# Altium project UZ_CarrierBoard.PrjPcb (part 10 of 10)
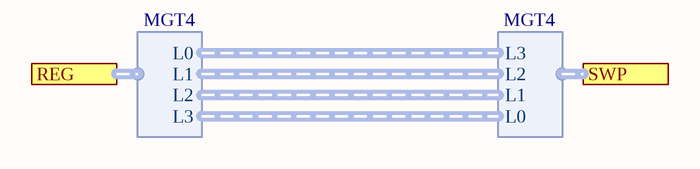
[diagram p42: Backpanel_SwapMGT4.SchDoc]

## Nets that join several sheets
1V8_PER: Signal_Distribution (R34ANL.2 R74.2 R75.2), U_Signal_Distribution/DIG1 (16 pins), U_Signal_Distribution/DIG2 (16 pins), U_Signal_Distribution/DIG3 (16 pins), U_Signal_Distribution/DIG4 (16 pins), U_Signal_Distribution/DIG5 (16 pins), Rail_Shutdown_AD (C82.1 U7.1), ETH-PHY (11 pins), SD_Card (C71.1 U13.5), isoDebug-Isolation (6 pins), Power_Supply_2 (R139.2 R139Y.2 R148.1), S3C_IOs1V8 (5 pins), S3C_SplitSPI (C118.2 U25.6 U25.16), S3C_FrontpanelInterface (R39.2 R40.2 R41.2), I2C_Subsystems (14 pins), I2C0_Mux (6 pins), Backpanel (R34BPs.2), U_Backpanel/U_Backpanel2T (X2A.20), U_Backpanel/U_Backpanel1B (X2B.20)
3V3_MOD: Signal_Distribution (R71.2), J1-3xGTHQ_R+B66 (5 pins), J2-1xGTHQ_L+1xGTHCLK+GTRQ+2xGTRCLK+4xPLLCLK+CFG+STAT (25 pins), J2_RefClkAndRTC (D4.2 L2.1), J3-3xGTHCLK+1xPLLCLK+MIO+B47+B48 (5 pins), Power_Supply_1 (10 pins)
3V3_PER: Signal_Distribution (5 pins), U_Signal_Distribution/DIG1 (18 pins), U_Signal_Distribution/DIG1/U_RP-SlotD (C78A.2 C79A.1 U9A.1), U_Signal_Distribution/DIG2 (18 pins), U_Signal_Distribution/DIG2/U_RP-SlotD (C78B.2 C79B.1 U9B.1), U_Signal_Distribution/DIG3 (18 pins), U_Signal_Distribution/DIG3/U_RP-SlotD (C78C.2 C79C.1 U9C.1), U_Signal_Distribution/DIG4 (18 pins), U_Signal_Distribution/DIG4/U_RP-SlotD (C78D.2 C79D.1 U9D.1), U_Signal_Distribution/DIG5 (18 pins), U_Signal_Distribution/DIG5/U_RP-SlotD (C78E.2 C79E.1 U9E.1), U_Signal_Distribution/ANL1/U_RP-SlotA (C78F.2 C79F.1 U9F.1), U_Signal_Distribution/ANL2/U_RP-SlotA (C78G.2 C79G.1 U9G.1), U_Signal_Distribution/ANL3/U_RP-SlotA (C78H.2 C79H.1 U9H.1), ANL_P54_Buffer (C116.2 L5.1 R32.1), ETH-PHY (5 pins), SD_Card (C72.2 U13.17 U13.21 X16.4), Thermal (9 pins), Power_Supply_1 (9 pins), Power_Supply_2 (D16.2 D18.2), S3C_IOs3V3 (U19.16), I2C_Subsystems (R67.2 R68.2 R69.2 X3.04), U_Backpanel/U_Backpanel2T (X2A.18), U_Backpanel/U_Backpanel1B (X2B.18)
3V3_S3C: Rail_Shutdown_AD (C83.1 U7.16), isoDebug-Isolation (Ci21.2 Ui7.10 Ui7.16), S3C (13 pins), S3C_IOs3V3 (10 pins), S3C_IOs1V8 (C114.2 U22.4 U22.6), S3C_SupplyAndMonitoring (6 pins), U_S3C_SupplyAndMonitoring/3V3_S3C (L12D.2 R140D.1 R141D.1 TP78D.1), U_S3C_SupplyAndMonitoring/U_PwrMon_VIN_10V (C139A.2 R106A.2 U28A.4), U_S3C_SupplyAndMonitoring/U_PwrMon_VIN_6V (C139B.2 R106B.2 U28B.4)
5V_PER: Signal_Distribution (R73.2), U_Signal_Distribution/DIG1/U_RP-SlotD (C36A.2 C39A.1 U8A.1), U_Signal_Distribution/DIG2/U_RP-SlotD (C36B.2 C39B.1 U8B.1), U_Signal_Distribution/DIG3/U_RP-SlotD (C36C.2 C39C.1 U8C.1), U_Signal_Distribution/DIG4/U_RP-SlotD (C36D.2 C39D.1 U8D.1), U_Signal_Distribution/DIG5/U_RP-SlotD (C36E.2 C39E.1 U8E.1), U_Signal_Distribution/ANL1/U_RP-SlotA (C36F.2 C39F.1 U8F.1), U_Signal_Distribution/ANL2/U_RP-SlotA (C36G.2 C39G.1 U8G.1), U_Signal_Distribution/ANL3/U_RP-SlotA (C36H.2 C39H.1 U8H.1), Power_Supply_1 (8 pins), S3C_FrontpanelInterface (U21.4), I2C_Subsystems (X3.05)
GND: Signal_Distribution (9 pins), U_Signal_Distribution/DIG1 (76 pins), U_Signal_Distribution/DIG1/U_RP-SlotD (18 pins), U_Signal_Distribution/DIG2 (76 pins), U_Signal_Distribution/DIG2/U_RP-SlotD (18 pins), U_Signal_Distribution/DIG3 (76 pins), U_Signal_Distribution/DIG3/U_RP-SlotD (18 pins), U_Signal_Distribution/DIG4 (76 pins), U_Signal_Distribution/DIG4/U_RP-SlotD (18 pins), U_Signal_Distribution/DIG5 (76 pins), U_Signal_Distribution/DIG5/U_RP-SlotD (18 pins), U_Signal_Distribution/ANL1 (30 pins), U_Signal_Distribution/ANL1/U_RP-SlotA (18 pins), U_Signal_Distribution/ANL2 (30 pins), U_Signal_Distribution/ANL2/U_RP-SlotA (18 pins), U_Signal_Distribution/ANL3 (30 pins), U_Signal_Distribution/ANL3/U_RP-SlotA (18 pins), Rail_Shutdown_AD (C82.2 C83.2 U7.2 U7.8), ANL_P54_Buffer (C84.1 C85.1 C116.1 U14.4), SoM (SNAP1.2 SNAP1.4), J1-3xGTHQ_R+B66 (50 pins), J2-1xGTHQ_L+1xGTHCLK+GTRQ+2xGTRCLK+4xPLLCLK+CFG+STAT (60 pins), J2_RefClkAndRTC (8 pins), J3-3xGTHCLK+1xPLLCLK+MIO+B47+B48 (30 pins), J4-B64+B65 (44 pins), ETH-PHY (21 pins), SD_Card (10 pins), User_Connectors (C92D.1 C93D.1), isoDebug-Isolation (9 pins), Thermal (10 pins), U_User_Connectors/12V_FAN (11 pins), Power_Supply_1 (53 pins), Power_Supply_2 (6 pins), U_Power_Supply_2/1V8_PER (11 pins), U_Power_Supply_2/1V8_MOD (11 pins), Power_Supply_Input (9 pins), S3C (20 pins), S3C_IOs3V3 (7 pins), S3C_IOs1V8 (7 pins), S3C_SplitSPI (C118.1 U25.4 U25.5 U25.8), S3C_FrontpanelInterface (U20.9 U21.9), S3C_SupplyAndMonitoring (12 pins), U_S3C_SupplyAndMonitoring/3V3_S3C (11 pins), U_S3C_SupplyAndMonitoring/U_PwrMon_VIN_10V (5 pins), U_S3C_SupplyAndMonitoring/U_PwrMon_VIN_6V (5 pins), I2C_Subsystems (8 pins), I2C0_Mux (C4.1 U6.12), Backpanel (7 pins), U_Backpanel/U_Backpanel2T (14 pins), U_Backpanel/U_Backpanel2T/U_RP-BP (5 pins), U_Backpanel/U_Backpanel1B (14 pins), U_Backpanel/U_Backpanel1B/U_RP-BP (5 pins)
isoDebug3V3: isoDebug (Ci1.2 Ri1.2 TPi2.1 Ui1.1), isoDebug-FTDI (16 pins), isoDebug-Isolation (9 pins)
isoDebugGND: isoDebug (6 pins), isoDebug-FTDI (22 pins), isoDebug-Isolation (9 pins)
PS_1V8: J2-1xGTHQ_L+1xGTHCLK+GTRQ+2xGTRCLK+4xPLLCLK+CFG+STAT (8 pins), J3-3xGTHCLK+1xPLLCLK+MIO+B47+B48 (J3.147 J3.148)
VCCO_47: J3-3xGTHCLK+1xPLLCLK+MIO+B47+B48 (J3.43 J3.44), Power_Supply_2 (R128.2)
VCCO_48: J3-3xGTHCLK+1xPLLCLK+MIO+B47+B48 (J3.15 J3.16), Power_Supply_2 (R129.2)
VCCO_64: J4-B64+B65 (J4.58 J4.106), Power_Supply_2 (R133.2)
VCCO_65: J4-B64+B65 (J4.69 J4.105), Power_Supply_2 (R131.2)
VCCO_66: J1-3xGTHQ_R+B66 (J1.90 J1.120), Power_Supply_2 (R136.2)
VIN: Signal_Distribution (R70.2), U_Signal_Distribution/DIG1/U_RP-SlotD (C86AD-A.2 R32AD-A.2 U1AD-A.8), U_Signal_Distribution/DIG2/U_RP-SlotD (C86AD-B.2 R32AD-B.2 U1AD-B.8), U_Signal_Distribution/DIG3/U_RP-SlotD (C86AD-C.2 R32AD-C.2 U1AD-C.8), U_Signal_Distribution/DIG4/U_RP-SlotD (C86AD-D.2 R32AD-D.2 U1AD-D.8), U_Signal_Distribution/DIG5/U_RP-SlotD (C86AD-E.2 R32AD-E.2 U1AD-E.8), U_Signal_Distribution/ANL1/U_RP-SlotA (C86AD-F.2 R32AD-F.2 U1AD-F.8), U_Signal_Distribution/ANL2/U_RP-SlotA (C86AD-G.2 R32AD-G.2 U1AD-G.8), U_Signal_Distribution/ANL3/U_RP-SlotA (C86AD-H.2 R32AD-H.2 U1AD-H.8), J2-1xGTHQ_L+1xGTHCLK+GTRQ+2xGTRCLK+4xPLLCLK+CFG+STAT (R8.2), U_User_Connectors/12V_FAN (L11A.2), Power_Supply_1 (L6.2 L7.2 L8.2), U_Power_Supply_2/1V8_PER (L11B.2), U_Power_Supply_2/1V8_MOD (L11C.2), Power_Supply_Input (12 pins), S3C_SupplyAndMonitoring (D6.2), U_Backpanel/U_Backpanel2T/U_RP-BP (C86BP-A.2 R32BP-A.2 U1BP-A.8), U_Backpanel/U_Backpanel1B/U_RP-BP (C86BP-B.2 R32BP-B.2 U1BP-B.8)
1V8out_MOD: Power_Supply_2 (C92A.2 C93A.2 R130.1), U_Power_Supply_2/1V8_MOD (L12C.2 R140C.1 R141C.1 TP78C.1)
1V8out_PER: Power_Supply_2 (C92B.2 C93B.2 R139.1), U_Power_Supply_2/1V8_PER (L12B.2 R140B.1 R141B.1 TP78B.1)
3V3_PROTECTED_ASLOT-_ANL1: U_Signal_Distribution/ANL1 (X5A.13 X5A.14), U_Signal_Distribution/ANL1/U_RP-SlotA (C80F.1 C81F.2 U9F.6)
3V3_PROTECTED_ASLOT-_ANL2: U_Signal_Distribution/ANL2 (X5B.13 X5B.14), U_Signal_Distribution/ANL2/U_RP-SlotA (C80G.1 C81G.2 U9G.6)
3V3_PROTECTED_ASLOT-_ANL3: U_Signal_Distribution/ANL3 (X5C.13 X5C.14), U_Signal_Distribution/ANL3/U_RP-SlotA (C80H.1 C81H.2 U9H.6)
3V3_PROTECTED_DSLOT-_DIG1: U_Signal_Distribution/DIG1 (X6A.13 X6A.14), U_Signal_Distribution/DIG1/U_RP-SlotD (C80A.1 C81A.2 U9A.6)
3V3_PROTECTED_DSLOT-_DIG2: U_Signal_Distribution/DIG2 (X6B.13 X6B.14), U_Signal_Distribution/DIG2/U_RP-SlotD (C80B.1 C81B.2 U9B.6)
3V3_PROTECTED_DSLOT-_DIG3: U_Signal_Distribution/DIG3 (X6C.13 X6C.14), U_Signal_Distribution/DIG3/U_RP-SlotD (C80C.1 C81C.2 U9C.6)
3V3_PROTECTED_DSLOT-_DIG4: U_Signal_Distribution/DIG4 (X6D.13 X6D.14), U_Signal_Distribution/DIG4/U_RP-SlotD (C80D.1 C81D.2 U9D.6)
3V3_PROTECTED_DSLOT-_DIG5: U_Signal_Distribution/DIG5 (X6E.13 X6E.14), U_Signal_Distribution/DIG5/U_RP-SlotD (C80E.1 C81E.2 U9E.6)
5V_PROTECTED_ASLOT-_ANL1: U_Signal_Distribution/ANL1 (X5A.9 X5A.10), U_Signal_Distribution/ANL1/U_RP-SlotA (C76F.1 C77F.2 U8F.6)
5V_PROTECTED_ASLOT-_ANL2: U_Signal_Distribution/ANL2 (X5B.9 X5B.10), U_Signal_Distribution/ANL2/U_RP-SlotA (C76G.1 C77G.2 U8G.6)
5V_PROTECTED_ASLOT-_ANL3: U_Signal_Distribution/ANL3 (X5C.9 X5C.10), U_Signal_Distribution/ANL3/U_RP-SlotA (C76H.1 C77H.2 U8H.6)
5V_PROTECTED_DSLOT-_DIG1: U_Signal_Distribution/DIG1 (X6A.9 X6A.10), U_Signal_Distribution/DIG1/U_RP-SlotD (C76A.1 C77A.2 U8A.6)
5V_PROTECTED_DSLOT-_DIG2: U_Signal_Distribution/DIG2 (X6B.9 X6B.10), U_Signal_Distribution/DIG2/U_RP-SlotD (C76B.1 C77B.2 U8B.6)
5V_PROTECTED_DSLOT-_DIG3: U_Signal_Distribution/DIG3 (X6C.9 X6C.10), U_Signal_Distribution/DIG3/U_RP-SlotD (C76C.1 C77C.2 U8C.6)
5V_PROTECTED_DSLOT-_DIG4: U_Signal_Distribution/DIG4 (X6D.9 X6D.10), U_Signal_Distribution/DIG4/U_RP-SlotD (C76D.1 C77D.2 U8D.6)
5V_PROTECTED_DSLOT-_DIG5: U_Signal_Distribution/DIG5 (X6E.9 X6E.10), U_Signal_Distribution/DIG5/U_RP-SlotD (C76E.1 C77E.2 U8E.6)
12V_FAN: User_Connectors (C92D.2 C93D.2), Thermal (6 pins), U_User_Connectors/12V_FAN (L12A.2 R140A.1 R141A.1 TP78A.1)
ADDR0: Signal_Distribution (NT1.1), U_Signal_Distribution/ANL1 (X5A.61)
ADDR0: Signal_Distribution (NT4.1), U_Signal_Distribution/ANL3 (X5C.61)
ADDR0_D2: Signal_Distribution (NT6.1), U_Signal_Distribution/DIG2 (X6B.79)
ADDR0_D4: Signal_Distribution (NT9.1), U_Signal_Distribution/DIG4 (X6D.79)
ADDR1: Signal_Distribution (NT2.1), U_Signal_Distribution/ANL1 (X5A.77)
ADDR1: Signal_Distribution (NT3.1), U_Signal_Distribution/ANL2 (X5B.77)
ADDR1_D2: Signal_Distribution (NT7.1), U_Signal_Distribution/DIG2 (X6B.95)
ADDR1_D3: Signal_Distribution (NT8.1), U_Signal_Distribution/DIG3 (X6C.95)
ADDR2_D1: Signal_Distribution (NT5.1), U_Signal_Distribution/DIG1 (X6A.80)
ANL_00_N: U_Signal_Distribution/ANL1 (X5A.19), J4-B64+B65 (J4.126)
ANL_00_N: U_Signal_Distribution/ANL2 (X5B.19), J4-B64+B65 (J4.80)
ANL_00_N: U_Signal_Distribution/ANL3 (X5C.19), J4-B64+B65 (J4.65)
ANL_00_P: U_Signal_Distribution/ANL1 (X5A.17), J4-B64+B65 (J4.128)
ANL_00_P: U_Signal_Distribution/ANL2 (X5B.17), J4-B64+B65 (J4.78)
ANL_00_P: U_Signal_Distribution/ANL3 (X5C.17), J4-B64+B65 (J4.67)
ANL_01_N: U_Signal_Distribution/ANL1 (X5A.20), J4-B64+B65 (J4.144)
ANL_01_N: U_Signal_Distribution/ANL2 (X5B.20), J4-B64+B65 (J4.90)
ANL_01_N: U_Signal_Distribution/ANL3 (X5C.20), J4-B64+B65 (J4.44)
ANL_01_P: U_Signal_Distribution/ANL1 (X5A.18), J4-B64+B65 (J4.146)
ANL_01_P: U_Signal_Distribution/ANL2 (X5B.18), J4-B64+B65 (J4.92)
ANL_01_P: U_Signal_Distribution/ANL3 (X5C.18), J4-B64+B65 (J4.42)
ANL_02_N: U_Signal_Distribution/ANL1 (X5A.25), J4-B64+B65 (J4.138)
ANL_02_N: U_Signal_Distribution/ANL2 (X5B.25), J4-B64+B65 (J4.84)
ANL_02_N: U_Signal_Distribution/ANL3 (X5C.25), J4-B64+B65 (J4.38)
ANL_02_P: U_Signal_Distribution/ANL1 (X5A.23), J4-B64+B65 (J4.140)
ANL_02_P: U_Signal_Distribution/ANL2 (X5B.23), J4-B64+B65 (J4.86)
ANL_02_P: U_Signal_Distribution/ANL3 (X5C.23), J4-B64+B65 (J4.36)
ANL_03_N: U_Signal_Distribution/ANL1 (X5A.26), J4-B64+B65 (J4.132)
ANL_03_N: U_Signal_Distribution/ANL2 (X5B.26), J4-B64+B65 (J4.96)
ANL_03_N: U_Signal_Distribution/ANL3 (X5C.26), J4-B64+B65 (J4.35)
ANL_03_P: U_Signal_Distribution/ANL1 (X5A.24), J4-B64+B65 (J4.134)
ANL_03_P: U_Signal_Distribution/ANL2 (X5B.24), J4-B64+B65 (J4.98)
ANL_03_P: U_Signal_Distribution/ANL3 (X5C.24), J4-B64+B65 (J4.37)
ANL_04_N: U_Signal_Distribution/ANL1 (X5A.31), J4-B64+B65 (J4.133)
ANL_04_N: U_Signal_Distribution/ANL2 (X5B.31), J4-B64+B65 (J4.48)
ANL_04_N: U_Signal_Distribution/ANL3 (X5C.31), J4-B64+B65 (J4.30)
ANL_04_P: U_Signal_Distribution/ANL1 (X5A.29), J4-B64+B65 (J4.131)
ANL_04_P: U_Signal_Distribution/ANL2 (X5B.29), J4-B64+B65 (J4.50)
ANL_04_P: U_Signal_Distribution/ANL3 (X5C.29), J4-B64+B65 (J4.32)
ANL_05_N: U_Signal_Distribution/ANL1 (X5A.32), J4-B64+B65 (J4.152)
ANL_05_N: U_Signal_Distribution/ANL2 (X5B.32), J4-B64+B65 (J4.66)
ANL_05_N: U_Signal_Distribution/ANL3 (X5C.32), J4-B64+B65 (J4.31)
ANL_05_P: U_Signal_Distribution/ANL1 (X5A.30), J4-B64+B65 (J4.150)
ANL_05_P: U_Signal_Distribution/ANL2 (X5B.30), J4-B64+B65 (J4.68)
ANL_05_P: U_Signal_Distribution/ANL3 (X5C.30), J4-B64+B65 (J4.29)
ANL_06_N: U_Signal_Distribution/ANL1 (X5A.37), J4-B64+B65 (J4.120)
ANL_06_N: U_Signal_Distribution/ANL2 (X5B.37), J4-B64+B65 (J4.62)
ANL_06_N: U_Signal_Distribution/ANL3 (X5C.37), J4-B64+B65 (J4.26)
ANL_06_P: U_Signal_Distribution/ANL1 (X5A.35), J4-B64+B65 (J4.122)
ANL_06_P: U_Signal_Distribution/ANL2 (X5B.35), J4-B64+B65 (J4.60)
ANL_06_P: U_Signal_Distribution/ANL3 (X5C.35), J4-B64+B65 (J4.24)
ANL_07_N: U_Signal_Distribution/ANL1 (X5A.38), J4-B64+B65 (J4.116)
ANL_07_N: U_Signal_Distribution/ANL2 (X5B.38), J4-B64+B65 (J4.56)
ANL_07_N: U_Signal_Distribution/ANL3 (X5C.38), J4-B64+B65 (J4.20)
ANL_07_P: U_Signal_Distribution/ANL1 (X5A.36), J4-B64+B65 (J4.114)
ANL_07_P: U_Signal_Distribution/ANL2 (X5B.36), J4-B64+B65 (J4.54)
ANL_07_P: U_Signal_Distribution/ANL3 (X5C.36), J4-B64+B65 (J4.18)
ANL_08_N: U_Signal_Distribution/ANL1 (X5A.43), J4-B64+B65 (J4.108)
ANL_08_N: U_Signal_Distribution/ANL2 (X5B.43), J4-B64+B65 (J4.55)
ANL_08_N: U_Signal_Distribution/ANL3 (X5C.43), J4-B64+B65 (J4.17)
ANL_08_P: U_Signal_Distribution/ANL1 (X5A.41), J4-B64+B65 (J4.110)
ANL_08_P: U_Signal_Distribution/ANL2 (X5B.41), J4-B64+B65 (J4.53)
ANL_08_P: U_Signal_Distribution/ANL3 (X5C.41), J4-B64+B65 (J4.19)
ANL_09_N: U_Signal_Distribution/ANL1 (X5A.44), J4-B64+B65 (J4.91)
ANL_09_N: U_Signal_Distribution/ANL2 (X5B.44), J4-B64+B65 (J4.72)
ANL_09_N: U_Signal_Distribution/ANL3 (X5C.44), J4-B64+B65 (J4.77)
ANL_09_P: U_Signal_Distribution/ANL1 (X5A.42), J4-B64+B65 (J4.89)
ANL_09_P: U_Signal_Distribution/ANL2 (X5B.42), J4-B64+B65 (J4.74)
ANL_09_P: U_Signal_Distribution/ANL3 (X5C.42), J4-B64+B65 (J4.79)
ANL_P54_Clk1: U_Signal_Distribution/ANL1 (X5A.54), ANL_P54_Buffer (R36.1)
ANL_P54_Clk2: U_Signal_Distribution/ANL2 (X5B.54), ANL_P54_Buffer (R35.1)
ANL_P54_Clk3: U_Signal_Distribution/ANL3 (X5C.54), ANL_P54_Buffer (R34.1)
ANL_Rail~{FAULT}: Signal_Distribution (R35ANL.2), S3C_IOs1V8 (U19.42)
ANL_S3C.CarrierReady: U_Signal_Distribution/ANL1 (X5A.79), U_Signal_Distribution/ANL2 (X5B.79), U_Signal_Distribution/ANL3 (X5C.79)
ASlots_SCL_3V3: Signal_Distribution (R97.1), U_Signal_Distribution/ANL1 (X5A.49), U_Signal_Distribution/ANL2 (X5B.49), U_Signal_Distribution/ANL3 (X5C.49), I2C0_Mux (U6.7)
ASlots_SDA_3V3: Signal_Distribution (R99.1), U_Signal_Distribution/ANL1 (X5A.50), U_Signal_Distribution/ANL2 (X5B.50), U_Signal_Distribution/ANL3 (X5C.50), I2C0_Mux (U6.6)
B64_L5_N: U_Signal_Distribution/DIG1 (U4A.43), J4-B64+B65 (J4.104)
B64_L5_P: U_Signal_Distribution/DIG1 (U4A.45), J4-B64+B65 (J4.102)
B64_L24_N: U_Signal_Distribution/DIG1 (U4A.99), J4-B64+B65 (J4.12)
B64_L24_P: U_Signal_Distribution/DIG1 (U4A.98), J4-B64+B65 (J4.14)
B64_T0: J4-B64+B65 (J4.8), S3C_IOs1V8 (U19.73)
B64_T1: J4-B64+B65 (J4.6), S3C_IOs1V8 (U19.74)
B64_T2: J4-B64+B65 (J4.2), S3C_IOs1V8 (U19.76)
B64_T3: J4-B64+B65 (J4.4), S3C_IOs1V8 (U19.75)
B65_L1_N: U_Signal_Distribution/DIG1 (U4A.30), J4-B64+B65 (J4.145)
B65_L1_P: U_Signal_Distribution/DIG1 (U4A.29), J4-B64+B65 (J4.143)
B65_L2_N: U_Signal_Distribution/DIG1 (U4A.18), J4-B64+B65 (J4.125)
B65_L2_P: U_Signal_Distribution/DIG1 (U4A.19), J4-B64+B65 (J4.127)
B65_L3_N: U_Signal_Distribution/DIG1 (U4A.20), J4-B64+B65 (J4.137)
B65_L3_P: U_Signal_Distribution/DIG1 (U4A.21), J4-B64+B65 (J4.139)
B65_L4_N: U_Signal_Distribution/DIG1 (U4A.38), J4-B64+B65 (J4.107)
B65_L4_P: U_Signal_Distribution/DIG1 (U4A.34), J4-B64+B65 (J4.109)
B65_L5_N: U_Signal_Distribution/DIG1 (U4A.28), J4-B64+B65 (J4.151)
B65_L5_P: U_Signal_Distribution/DIG1 (U4A.27), J4-B64+B65 (J4.149)
B65_L6_N: U_Signal_Distribution/DIG1 (U4A.84), J4-B64+B65 (J4.83)
B65_L6_P: U_Signal_Distribution/DIG1 (U4A.47), J4-B64+B65 (J4.85)
B65_L7_N: U_Signal_Distribution/DIG1 (U4A.78), J4-B64+B65 (J4.71)
B65_L7_P: U_Signal_Distribution/DIG1 (U4A.83), J4-B64+B65 (J4.73)
B65_L8_N: U_Signal_Distribution/DIG1 (U4A.24), J4-B64+B65 (J4.121)
B65_L8_P: U_Signal_Distribution/DIG1 (U4A.37), J4-B64+B65 (J4.119)
B65_L9_N: U_Signal_Distribution/DIG1 (U4A.41), J4-B64+B65 (J4.101)
B65_L9_P: U_Signal_Distribution/DIG1 (U4A.39), J4-B64+B65 (J4.103)
B65_L10_N: U_Signal_Distribution/DIG1 (U4A.42), J4-B64+B65 (J4.95)
B65_L10_P: U_Signal_Distribution/DIG1 (U4A.40), J4-B64+B65 (J4.97)
B65_L14_N: U_Signal_Distribution/DIG1 (U4A.35), J4-B64+B65 (J4.113)
B65_L14_P: U_Signal_Distribution/DIG1 (U4A.36), J4-B64+B65 (J4.115)
B65_L15_N: U_Signal_Distribution/DIG1 (U4A.88), J4-B64+B65 (J4.59)
B65_L15_P: U_Signal_Distribution/DIG1 (U4A.87), J4-B64+B65 (J4.61)
B65_L19_N: U_Signal_Distribution/DIG1 (U4A.97), J4-B64+B65 (J4.49)
B65_L19_P: U_Signal_Distribution/DIG1 (U4A.96), J4-B64+B65 (J4.47)
B65_L22_N: U_Signal_Distribution/DIG2 (U4B.30), J4-B64+B65 (J4.25)
B65_L22_P: U_Signal_Distribution/DIG2 (U4B.29), J4-B64+B65 (J4.23)
B65_L23_N: U_Signal_Distribution/DIG2 (U4B.27), J4-B64+B65 (J4.41)
B65_L23_P: U_Signal_Distribution/DIG2 (U4B.28), J4-B64+B65 (J4.43)
B65_L24_N: U_Signal_Distribution/DIG2 (U4B.21), J4-B64+B65 (J4.13)
B65_L24_P: U_Signal_Distribution/DIG2 (U4B.20), J4-B64+B65 (J4.11)
B65_T0: U_Signal_Distribution/DIG2 (U4B.19), J4-B64+B65 (J4.7)
B65_T1: U_Signal_Distribution/DIG2 (U4B.18), J4-B64+B65 (J4.5)
B65_T2: U_Signal_Distribution/DIG2 (U4B.24), J4-B64+B65 (J4.3)
B65_T3: U_Signal_Distribution/DIG2 (U4B.37), J4-B64+B65 (J4.1)
B66_L23_N: J1-3xGTHQ_R+B66 (J1.110), S3C_IOs1V8 (U19.78)
B66_L23_P: J1-3xGTHQ_R+B66 (J1.112), S3C_IOs1V8 (U19.77)
B128_CLK1_N: J2-1xGTHQ_L+1xGTHCLK+GTRQ+2xGTRCLK+4xPLLCLK+CFG+STAT (J2.24), U_Backpanel/U_Backpanel2T (X2A.4)
B128_CLK1_P: J2-1xGTHQ_L+1xGTHCLK+GTRQ+2xGTRCLK+4xPLLCLK+CFG+STAT (J2.22), U_Backpanel/U_Backpanel2T (X2A.6)
B230_CLK1_N: J3-3xGTHCLK+1xPLLCLK+MIO+B47+B48 (J3.59), U_Backpanel/U_Backpanel1B (X2B.4)
B230_CLK1_P: J3-3xGTHCLK+1xPLLCLK+MIO+B47+B48 (J3.61), U_Backpanel/U_Backpanel1B (X2B.6)
B505_CLKb_N: J2-1xGTHQ_L+1xGTHCLK+GTRQ+2xGTRCLK+4xPLLCLK+CFG+STAT (J2.18), J2_RefClkAndRTC (C97.2)
B505_CLKb_P: J2-1xGTHQ_L+1xGTHCLK+GTRQ+2xGTRCLK+4xPLLCLK+CFG+STAT (J2.16), J2_RefClkAndRTC (C2.2)
Carrier_PG_1V8: Rail_Shutdown_AD (R15.1), ETH-PHY (R210.1 U2.16), S3C_IOs1V8 (U19.107)
Carrier_PwrOn: User_Connectors (R203D.1), Power_Supply_1 (R108.2 U10.3), S3C_IOs3V3 (U19.1)
CLK0_N: GTH (C152.1), J2-1xGTHQ_L+1xGTHCLK+GTRQ+2xGTRCLK+4xPLLCLK+CFG+STAT (J2.1)
CLK0_P: GTH (C151.1), J2-1xGTHQ_L+1xGTHCLK+GTRQ+2xGTRCLK+4xPLLCLK+CFG+STAT (J2.3)
CLK7_N: GTH (C101.1), J2-1xGTHQ_L+1xGTHCLK+GTRQ+2xGTRCLK+4xPLLCLK+CFG+STAT (J2.15)
CLK7_P: GTH (C100.1), J2-1xGTHQ_L+1xGTHCLK+GTRQ+2xGTRCLK+4xPLLCLK+CFG+STAT (J2.13)
CLK8_N: GTH (C150.1), J2-1xGTHQ_L+1xGTHCLK+GTRQ+2xGTRCLK+4xPLLCLK+CFG+STAT (J2.9)
CLK8_P: GTH (C149.1), J2-1xGTHQ_L+1xGTHCLK+GTRQ+2xGTRCLK+4xPLLCLK+CFG+STAT (J2.7)
CPLD_TCK: U_Signal_Distribution/DIG1 (U4A.91), U_Signal_Distribution/DIG2 (U4B.91), U_Signal_Distribution/DIG3 (U4C.91), U_Signal_Distribution/DIG4 (U4D.91), U_Signal_Distribution/DIG5 (U4E.91)
CPLD_TDI2: U_Signal_Distribution/DIG1 (U4A.95), U_Signal_Distribution/DIG2 (U4B.94)
CPLD_TDI3: U_Signal_Distribution/DIG2 (U4B.95), U_Signal_Distribution/DIG3 (U4C.94)
CPLD_TDI4: U_Signal_Distribution/DIG3 (U4C.95), U_Signal_Distribution/DIG4 (U4D.94)
CPLD_TDI5: U_Signal_Distribution/DIG4 (U4D.95), U_Signal_Distribution/DIG5 (U4E.94)
CPLD_TMS: U_Signal_Distribution/DIG1 (U4A.90), U_Signal_Distribution/DIG2 (U4B.90), U_Signal_Distribution/DIG3 (U4C.90), U_Signal_Distribution/DIG4 (U4D.90), U_Signal_Distribution/DIG5 (U4E.90)
CPLDs_SCL_1V8: Signal_Distribution (R74.1), U_Signal_Distribution/DIG1 (U4A.86), U_Signal_Distribution/DIG2 (U4B.86), U_Signal_Distribution/DIG3 (U4C.86), U_Signal_Distribution/DIG4 (U4D.86), U_Signal_Distribution/DIG5 (U4E.86), I2C0_Mux (U6.9)
CPLDs_SDA_1V8: Signal_Distribution (R75.1), U_Signal_Distribution/DIG1 (U4A.85), U_Signal_Distribution/DIG2 (U4B.85), U_Signal_Distribution/DIG3 (U4C.85), U_Signal_Distribution/DIG4 (U4D.85), U_Signal_Distribution/DIG5 (U4E.85), I2C0_Mux (U6.8)
DIG_00_Ch2: U_Signal_Distribution/DIG2 (U4B.78), J1-3xGTHQ_R+B66 (J1.130)
DIG_00_Ch3: U_Signal_Distribution/DIG3 (U4C.78), J1-3xGTHQ_R+B66 (J1.80)
DIG_00_Ch4: U_Signal_Distribution/DIG4 (U4D.78), J3-3xGTHCLK+1xPLLCLK+MIO+B47+B48 (J3.32)
DIG_00_Ch5: U_Signal_Distribution/DIG5 (U4E.78), S3C_IOs1V8 (U19.28)
DIG_01_Ch2: U_Signal_Distribution/DIG2 (U4B.83), J1-3xGTHQ_R+B66 (J1.131)
DIG_01_Ch3: U_Signal_Distribution/DIG3 (U4C.83), J1-3xGTHQ_R+B66 (J1.81)
DIG_01_Ch4: U_Signal_Distribution/DIG4 (U4D.83), J3-3xGTHCLK+1xPLLCLK+MIO+B47+B48 (J3.31)
DIG_01_Ch5: U_Signal_Distribution/DIG5 (U4E.83), S3C_IOs1V8 (U19.32)
DIG_02_Ch2: U_Signal_Distribution/DIG2 (U4B.84), J1-3xGTHQ_R+B66 (J1.134)
DIG_02_Ch3: U_Signal_Distribution/DIG3 (U4C.84), J1-3xGTHQ_R+B66 (J1.82)
DIG_02_Ch4: U_Signal_Distribution/DIG4 (U4D.84), J3-3xGTHCLK+1xPLLCLK+MIO+B47+B48 (J3.28)
DIG_02_Ch5: U_Signal_Distribution/DIG5 (U4E.84), S3C_IOs1V8 (U19.31)
DIG_03_Ch2: U_Signal_Distribution/DIG2 (U4B.47), J1-3xGTHQ_R+B66 (J1.135)
DIG_03_Ch3: U_Signal_Distribution/DIG3 (U4C.47), J1-3xGTHQ_R+B66 (J1.83)
DIG_03_Ch4: U_Signal_Distribution/DIG4 (U4D.47), J3-3xGTHCLK+1xPLLCLK+MIO+B47+B48 (J3.27)
DIG_03_Ch5: U_Signal_Distribution/DIG5 (U4E.47), S3C_IOs1V8 (U19.25)
DIG_04_Ch2: U_Signal_Distribution/DIG2 (U4B.45), J1-3xGTHQ_R+B66 (J1.136)
DIG_04_Ch3: U_Signal_Distribution/DIG3 (U4C.45), J1-3xGTHQ_R+B66 (J1.86)
DIG_04_Ch4: U_Signal_Distribution/DIG4 (U4D.45), J3-3xGTHCLK+1xPLLCLK+MIO+B47+B48 (J3.26)
DIG_04_Ch5: U_Signal_Distribution/DIG5 (U4E.45), S3C_IOs1V8 (U19.26)
DIG_05_Ch2: U_Signal_Distribution/DIG2 (U4B.43), J1-3xGTHQ_R+B66 (J1.137)
DIG_05_Ch3: U_Signal_Distribution/DIG3 (U4C.43), J1-3xGTHQ_R+B66 (J1.87)
DIG_05_Ch4: U_Signal_Distribution/DIG4 (U4D.43), J3-3xGTHCLK+1xPLLCLK+MIO+B47+B48 (J3.25)
DIG_05_Ch5: U_Signal_Distribution/DIG5 (U4E.43), S3C_IOs1V8 (U19.27)
DIG_06_Ch2: U_Signal_Distribution/DIG2 (U4B.42), J1-3xGTHQ_R+B66 (J1.140)
DIG_06_Ch3: U_Signal_Distribution/DIG3 (U4C.42), J1-3xGTHQ_R+B66 (J1.88)
DIG_06_Ch4: U_Signal_Distribution/DIG4 (U4D.42), J3-3xGTHCLK+1xPLLCLK+MIO+B47+B48 (J3.24)
DIG_06_Ch5: U_Signal_Distribution/DIG5 (U4E.42), J1-3xGTHQ_R+B66 (J1.119)
DIG_07_Ch2: U_Signal_Distribution/DIG2 (U4B.40), J1-3xGTHQ_R+B66 (J1.141)
DIG_07_Ch3: U_Signal_Distribution/DIG3 (U4C.40), J1-3xGTHQ_R+B66 (J1.89)
DIG_07_Ch4: U_Signal_Distribution/DIG4 (U4D.40), J3-3xGTHCLK+1xPLLCLK+MIO+B47+B48 (J3.23)
DIG_07_Ch5: U_Signal_Distribution/DIG5 (U4E.40), J1-3xGTHQ_R+B66 (J1.117)
DIG_08_Ch2: U_Signal_Distribution/DIG2 (U4B.41), J1-3xGTHQ_R+B66 (J1.142)
DIG_08_Ch3: U_Signal_Distribution/DIG3 (U4C.41), J1-3xGTHQ_R+B66 (J1.92)
DIG_08_Ch4: U_Signal_Distribution/DIG4 (U4D.41), J3-3xGTHCLK+1xPLLCLK+MIO+B47+B48 (J3.22)
DIG_08_Ch5: U_Signal_Distribution/DIG5 (U4E.41), J3-3xGTHCLK+1xPLLCLK+MIO+B47+B48 (J3.56)
DIG_09_Ch2: U_Signal_Distribution/DIG2 (U4B.39), J1-3xGTHQ_R+B66 (J1.143)
DIG_09_Ch3: U_Signal_Distribution/DIG3 (U4C.39), J1-3xGTHQ_R+B66 (J1.93)
DIG_09_Ch4: U_Signal_Distribution/DIG4 (U4D.39), J3-3xGTHCLK+1xPLLCLK+MIO+B47+B48 (J3.21)
DIG_09_Ch5: U_Signal_Distribution/DIG5 (U4E.39), J3-3xGTHCLK+1xPLLCLK+MIO+B47+B48 (J3.55)
DIG_10_Ch2: U_Signal_Distribution/DIG2 (U4B.38), J1-3xGTHQ_R+B66 (J1.145)
DIG_10_Ch3: U_Signal_Distribution/DIG3 (U4C.38), J1-3xGTHQ_R+B66 (J1.94)
DIG_10_Ch4: U_Signal_Distribution/DIG4 (U4D.38), J3-3xGTHCLK+1xPLLCLK+MIO+B47+B48 (J3.20)
DIG_10_Ch5: U_Signal_Distribution/DIG5 (U4E.38), J3-3xGTHCLK+1xPLLCLK+MIO+B47+B48 (J3.54)
DIG_11_Ch2: U_Signal_Distribution/DIG2 (U4B.34), J1-3xGTHQ_R+B66 (J1.146)
DIG_11_Ch3: U_Signal_Distribution/DIG3 (U4C.34), J1-3xGTHQ_R+B66 (J1.95)
DIG_11_Ch4: U_Signal_Distribution/DIG4 (U4D.34), J3-3xGTHCLK+1xPLLCLK+MIO+B47+B48 (J3.19)
DIG_11_Ch5: U_Signal_Distribution/DIG5 (U4E.34), J3-3xGTHCLK+1xPLLCLK+MIO+B47+B48 (J3.53)
DIG_12_Ch2: U_Signal_Distribution/DIG2 (U4B.35), J1-3xGTHQ_R+B66 (J1.147)
DIG_12_Ch3: U_Signal_Distribution/DIG3 (U4C.35), J1-3xGTHQ_R+B66 (J1.98)
DIG_12_Ch4: U_Signal_Distribution/DIG4 (U4D.35), J3-3xGTHCLK+1xPLLCLK+MIO+B47+B48 (J3.18)
DIG_12_Ch5: U_Signal_Distribution/DIG5 (U4E.35), J3-3xGTHCLK+1xPLLCLK+MIO+B47+B48 (J3.52)
DIG_13_Ch2: U_Signal_Distribution/DIG2 (U4B.36), J1-3xGTHQ_R+B66 (J1.148)
DIG_13_Ch3: U_Signal_Distribution/DIG3 (U4C.36), J1-3xGTHQ_R+B66 (J1.99)
DIG_13_Ch4: U_Signal_Distribution/DIG4 (U4D.36), J3-3xGTHCLK+1xPLLCLK+MIO+B47+B48 (J3.17)
DIG_13_Ch5: U_Signal_Distribution/DIG5 (U4E.36), J3-3xGTHCLK+1xPLLCLK+MIO+B47+B48 (J3.51)
DIG_14_Ch3: U_Signal_Distribution/DIG3 (U4C.37), J1-3xGTHQ_R+B66 (J1.100)
DIG_14_Ch4: U_Signal_Distribution/DIG4 (U4D.37), J3-3xGTHCLK+1xPLLCLK+MIO+B47+B48 (J3.14)
DIG_14_Ch5: U_Signal_Distribution/DIG5 (U4E.37), J3-3xGTHCLK+1xPLLCLK+MIO+B47+B48 (J3.50)
DIG_15_Ch3: U_Signal_Distribution/DIG3 (U4C.24), J1-3xGTHQ_R+B66 (J1.101)
DIG_15_Ch4: U_Signal_Distribution/DIG4 (U4D.24), J3-3xGTHCLK+1xPLLCLK+MIO+B47+B48 (J3.13)
DIG_15_Ch5: U_Signal_Distribution/DIG5 (U4E.24), J3-3xGTHCLK+1xPLLCLK+MIO+B47+B48 (J3.49)
DIG_16_Ch3: U_Signal_Distribution/DIG3 (U4C.18), J1-3xGTHQ_R+B66 (J1.104)
DIG_16_Ch4: U_Signal_Distribution/DIG4 (U4D.18), J3-3xGTHCLK+1xPLLCLK+MIO+B47+B48 (J3.12)
DIG_16_Ch5: U_Signal_Distribution/DIG5 (U4E.18), J3-3xGTHCLK+1xPLLCLK+MIO+B47+B48 (J3.48)
DIG_17_Ch3: U_Signal_Distribution/DIG3 (U4C.19), J1-3xGTHQ_R+B66 (J1.105)
DIG_17_Ch4: U_Signal_Distribution/DIG4 (U4D.19), J3-3xGTHCLK+1xPLLCLK+MIO+B47+B48 (J3.11)
DIG_17_Ch5: U_Signal_Distribution/DIG5 (U4E.19), J3-3xGTHCLK+1xPLLCLK+MIO+B47+B48 (J3.47)
DIG_18_Ch3: U_Signal_Distribution/DIG3 (U4C.20), J1-3xGTHQ_R+B66 (J1.106)
DIG_18_Ch4: U_Signal_Distribution/DIG4 (U4D.20), J3-3xGTHCLK+1xPLLCLK+MIO+B47+B48 (J3.10)
DIG_18_Ch5: U_Signal_Distribution/DIG5 (U4E.20), J3-3xGTHCLK+1xPLLCLK+MIO+B47+B48 (J3.46)
DIG_19_Ch3: U_Signal_Distribution/DIG3 (U4C.21), J1-3xGTHQ_R+B66 (J1.107)
DIG_19_Ch4: U_Signal_Distribution/DIG4 (U4D.21), J3-3xGTHCLK+1xPLLCLK+MIO+B47+B48 (J3.9)
DIG_19_Ch5: U_Signal_Distribution/DIG5 (U4E.21), J3-3xGTHCLK+1xPLLCLK+MIO+B47+B48 (J3.45)
DIG_20_Ch3: U_Signal_Distribution/DIG3 (U4C.29), J1-3xGTHQ_R+B66 (J1.111)
DIG_20_Ch4: U_Signal_Distribution/DIG4 (U4D.29), J3-3xGTHCLK+1xPLLCLK+MIO+B47+B48 (J3.8)
DIG_20_Ch5: U_Signal_Distribution/DIG5 (U4E.29), J3-3xGTHCLK+1xPLLCLK+MIO+B47+B48 (J3.42)
DIG_21_Ch3: U_Signal_Distribution/DIG3 (U4C.30), J1-3xGTHQ_R+B66 (J1.113)
DIG_21_Ch4: U_Signal_Distribution/DIG4 (U4D.30), J3-3xGTHCLK+1xPLLCLK+MIO+B47+B48 (J3.7)
DIG_21_Ch5: U_Signal_Distribution/DIG5 (U4E.30), J3-3xGTHCLK+1xPLLCLK+MIO+B47+B48 (J3.41)
DIG_22_Ch3: U_Signal_Distribution/DIG3 (U4C.27), J1-3xGTHQ_R+B66 (J1.116)
DIG_22_Ch4: U_Signal_Distribution/DIG4 (U4D.27), J3-3xGTHCLK+1xPLLCLK+MIO+B47+B48 (J3.6)
DIG_22_Ch5: U_Signal_Distribution/DIG5 (U4E.27), J3-3xGTHCLK+1xPLLCLK+MIO+B47+B48 (J3.40)
DIG_23_Ch3: U_Signal_Distribution/DIG3 (U4C.28), J1-3xGTHQ_R+B66 (J1.118)
DIG_23_Ch4: U_Signal_Distribution/DIG4 (U4D.28), J3-3xGTHCLK+1xPLLCLK+MIO+B47+B48 (J3.5)
DIG_23_Ch5: U_Signal_Distribution/DIG5 (U4E.28), J3-3xGTHCLK+1xPLLCLK+MIO+B47+B48 (J3.39)
DIG_24_Ch2: U_Signal_Distribution/DIG2 (U4B.99), J1-3xGTHQ_R+B66 (J1.122)
DIG_24_Ch3: U_Signal_Distribution/DIG3 (U4C.99), J3-3xGTHCLK+1xPLLCLK+MIO+B47+B48 (J3.4)
DIG_24_Ch4: U_Signal_Distribution/DIG4 (U4D.99), J3-3xGTHCLK+1xPLLCLK+MIO+B47+B48 (J3.38)
DIG_24_Ch5: U_Signal_Distribution/DIG5 (U4E.99), S3C_IOs1V8 (U19.40)
DIG_25_Ch2: U_Signal_Distribution/DIG2 (U4B.98), J1-3xGTHQ_R+B66 (J1.123)
DIG_25_Ch3: U_Signal_Distribution/DIG3 (U4C.98), J3-3xGTHCLK+1xPLLCLK+MIO+B47+B48 (J3.3)
DIG_25_Ch4: U_Signal_Distribution/DIG4 (U4D.98), J3-3xGTHCLK+1xPLLCLK+MIO+B47+B48 (J3.37)
DIG_25_Ch5: U_Signal_Distribution/DIG5 (U4E.98), S3C_IOs1V8 (U19.39)
DIG_26_Ch2: U_Signal_Distribution/DIG2 (U4B.97), J1-3xGTHQ_R+B66 (J1.124)
DIG_26_Ch3: U_Signal_Distribution/DIG3 (U4C.97), J1-3xGTHQ_R+B66 (J1.74)
DIG_26_Ch4: U_Signal_Distribution/DIG4 (U4D.97), J3-3xGTHCLK+1xPLLCLK+MIO+B47+B48 (J3.36)
DIG_26_Ch5: U_Signal_Distribution/DIG5 (U4E.97), S3C_IOs1V8 (U19.38)
DIG_27_Ch2: U_Signal_Distribution/DIG2 (U4B.96), J1-3xGTHQ_R+B66 (J1.125)
DIG_27_Ch3: U_Signal_Distribution/DIG3 (U4C.96), J1-3xGTHQ_R+B66 (J1.75)
DIG_27_Ch4: U_Signal_Distribution/DIG4 (U4D.96), J3-3xGTHCLK+1xPLLCLK+MIO+B47+B48 (J3.35)
DIG_27_Ch5: U_Signal_Distribution/DIG5 (U4E.96), S3C_IOs1V8 (U19.35)
DIG_28_Ch2: U_Signal_Distribution/DIG2 (U4B.88), J1-3xGTHQ_R+B66 (J1.128)
DIG_28_Ch3: U_Signal_Distribution/DIG3 (U4C.88), J1-3xGTHQ_R+B66 (J1.76)
DIG_28_Ch4: U_Signal_Distribution/DIG4 (U4D.88), J3-3xGTHCLK+1xPLLCLK+MIO+B47+B48 (J3.34)
DIG_28_Ch5: U_Signal_Distribution/DIG5 (U4E.88), S3C_IOs1V8 (U19.34)
DIG_29_Ch2: U_Signal_Distribution/DIG2 (U4B.87), J1-3xGTHQ_R+B66 (J1.129)
DIG_29_Ch3: U_Signal_Distribution/DIG3 (U4C.87), J1-3xGTHQ_R+B66 (J1.77)
DIG_29_Ch4: U_Signal_Distribution/DIG4 (U4D.87), J3-3xGTHCLK+1xPLLCLK+MIO+B47+B48 (J3.33)
DIG_29_Ch5: U_Signal_Distribution/DIG5 (U4E.87), S3C_IOs1V8 (U19.33)
DSlots_SCL_3V3: Signal_Distribution (R84.1), U_Signal_Distribution/DIG1 (X6A.89), U_Signal_Distribution/DIG2 (X6B.89), U_Signal_Distribution/DIG3 (X6C.89), U_Signal_Distribution/DIG4 (X6D.89), U_Signal_Distribution/DIG5 (X6E.89), I2C0_Mux (U6.11)
DSlots_SDA_3V3: Signal_Distribution (R85.1), U_Signal_Distribution/DIG1 (X6A.90), U_Signal_Distribution/DIG2 (X6B.90), U_Signal_Distribution/DIG3 (X6C.90), U_Signal_Distribution/DIG4 (X6D.90), U_Signal_Distribution/DIG5 (X6E.90), I2C0_Mux (U6.10)
Dummy-ExtSD.SD_CD: Backpanel (NT16.2), U_Backpanel/U_Backpanel1B (X2B.80)
Dummy-ExtSD.SD_CLK: Backpanel (NT15.2), U_Backpanel/U_Backpanel1B (X2B.72)
Dummy-ExtSD.SD_CMD: Backpanel (NT14.2), U_Backpanel/U_Backpanel1B (X2B.74)
Dummy-ExtSD.SD_DAT0: Backpanel (NT10.2), U_Backpanel/U_Backpanel1B (X2B.70)
Dummy-ExtSD.SD_DAT1: Backpanel (NT11.2), U_Backpanel/U_Backpanel1B (X2B.68)
Dummy-ExtSD.SD_DAT2: Backpanel (NT12.2), U_Backpanel/U_Backpanel1B (X2B.78)
Dummy-ExtSD.SD_DAT3: Backpanel (NT13.2), U_Backpanel/U_Backpanel1B (X2B.76)
EN_PLL_PWR: J2-1xGTHQ_L+1xGTHCLK+GTRQ+2xGTRCLK+4xPLLCLK+CFG+STAT (J2.77 R16.2 R21.1 SW2.5), J2_RefClkAndRTC (U5.1)
Enable: User_Connectors (R203D.2), U_User_Connectors/12V_FAN (R200A.2 TP79A.1 U23A.3)
Enable: Power_Supply_2 (R203A.2), U_Power_Supply_2/1V8_MOD (R200C.2 TP79C.1 U23C.3)
Enable: Power_Supply_2 (R203B.2), U_Power_Supply_2/1V8_PER (R200B.2 TP79B.1 U23B.3)
Enable: S3C_SupplyAndMonitoring (R102.2 R103.2), U_S3C_SupplyAndMonitoring/3V3_S3C (R200D.2 TP79D.1 U23D.3)
ETH_MDC: J3-3xGTHCLK+1xPLLCLK+MIO+B47+B48 (J3.143), ETH-PHY (U2.7)
ETH_MDIO: J3-3xGTHCLK+1xPLLCLK+MIO+B47+B48 (J3.144), ETH-PHY (R50.2 U2.8)
ETH_RXCK: J3-3xGTHCLK+1xPLLCLK+MIO+B47+B48 (J3.132), ETH-PHY (U2.46)
ETH_RXCTL: J3-3xGTHCLK+1xPLLCLK+MIO+B47+B48 (J3.142), ETH-PHY (U2.43)
ETH_RXD0: J3-3xGTHCLK+1xPLLCLK+MIO+B47+B48 (J3.134), ETH-PHY (U2.44)
ETH_RXD1: J3-3xGTHCLK+1xPLLCLK+MIO+B47+B48 (J3.136), ETH-PHY (U2.45)
ETH_RXD2: J3-3xGTHCLK+1xPLLCLK+MIO+B47+B48 (J3.138), ETH-PHY (U2.47)
ETH_RXD3: J3-3xGTHCLK+1xPLLCLK+MIO+B47+B48 (J3.140), ETH-PHY (U2.48)
ETH_TXCK: J3-3xGTHCLK+1xPLLCLK+MIO+B47+B48 (J3.131), ETH-PHY (U2.53)
ETH_TXCTL: J3-3xGTHCLK+1xPLLCLK+MIO+B47+B48 (J3.141), ETH-PHY (U2.56)
ETH_TXD0: J3-3xGTHCLK+1xPLLCLK+MIO+B47+B48 (J3.133), ETH-PHY (U2.50)
ETH_TXD1: J3-3xGTHCLK+1xPLLCLK+MIO+B47+B48 (J3.135), ETH-PHY (U2.51)
ETH_TXD2: J3-3xGTHCLK+1xPLLCLK+MIO+B47+B48 (J3.137), ETH-PHY (U2.54)
ETH_TXD3: J3-3xGTHCLK+1xPLLCLK+MIO+B47+B48 (J3.139), ETH-PHY (U2.55)
~{FAULT}_OD-: Signal_Distribution (R34ANL.1 R35ANL.1), U_Signal_Distribution/ANL1/U_RP-SlotA (U1AD-F.3 U8F.4 U9F.4), U_Signal_Distribution/ANL2/U_RP-SlotA (U1AD-G.3 U8G.4 U9G.4), U_Signal_Distribution/ANL3/U_RP-SlotA (U1AD-H.3 U8H.4 U9H.4)
~{FAULT}_OD_DSLOT-_DIG1: U_Signal_Distribution/DIG1 (R34DIG-A.1 R35DIG-A.1), U_Signal_Distribution/DIG1/U_RP-SlotD (U1AD-A.3 U8A.4 U9A.4)
~{FAULT}_OD_DSLOT-_DIG2: U_Signal_Distribution/DIG2 (R34DIG-B.1 R35DIG-B.1), U_Signal_Distribution/DIG2/U_RP-SlotD (U1AD-B.3 U8B.4 U9B.4)
~{FAULT}_OD_DSLOT-_DIG3: U_Signal_Distribution/DIG3 (R34DIG-C.1 R35DIG-C.1), U_Signal_Distribution/DIG3/U_RP-SlotD (U1AD-C.3 U8C.4 U9C.4)
~{FAULT}_OD_DSLOT-_DIG4: U_Signal_Distribution/DIG4 (R34DIG-D.1 R35DIG-D.1), U_Signal_Distribution/DIG4/U_RP-SlotD (U1AD-D.3 U8D.4 U9D.4)
~{FAULT}_OD_DSLOT-_DIG5: U_Signal_Distribution/DIG5 (R34DIG-E.1 R35DIG-E.1), U_Signal_Distribution/DIG5/U_RP-SlotD (U1AD-E.3 U8E.4 U9E.4)
FP_SysLEDb: S3C_IOs3V3 (U19.143), S3C_FrontpanelInterface (U21.8)
FP_SysLEDg: S3C_IOs3V3 (U19.141), S3C_FrontpanelInterface (U21.6)
FP_SysLEDr: S3C_IOs3V3 (U19.142), S3C_FrontpanelInterface (U21.7)
FP_SysLEDs: S3C_IOs1V8 (U19.104), S3C_FrontpanelInterface (U21.5)
FP_UsrLED1: S3C_IOs1V8 (U19.95), S3C_FrontpanelInterface (U20.4)
FP_UsrLED2: S3C_IOs1V8 (U19.96), S3C_FrontpanelInterface (U20.3)
FP_UsrLED3: S3C_IOs1V8 (U19.97), S3C_FrontpanelInterface (U20.2)
FP_UsrLED4: S3C_IOs1V8 (U19.98), S3C_FrontpanelInterface (U20.1)
FP_UsrSW1: S3C_IOs3V3 (U19.128), S3C_FrontpanelInterface (U21.1)
FP_UsrSW2: S3C_IOs3V3 (U19.127), S3C_FrontpanelInterface (U21.2)
FP_UsrSW3: S3C_IOs3V3 (U19.122), S3C_FrontpanelInterface (U21.3)
GTH_CLK_N: U_Signal_Distribution/ANL1 (X5A.74), GTH (C101.2)
GTH_CLK_N: U_Signal_Distribution/ANL2 (X5B.74), GTH (C150.2)
GTH_CLK_N: U_Signal_Distribution/ANL3 (X5C.74), GTH (C152.2)
GTH_CLK_P: U_Signal_Distribution/ANL1 (X5A.72), GTH (C100.2)
GTH_CLK_P: U_Signal_Distribution/ANL2 (X5B.72), GTH (C149.2)
GTH_CLK_P: U_Signal_Distribution/ANL3 (X5C.72), GTH (C151.2)
GTH_RX_N: U_Signal_Distribution/ANL1 (X5A.71), GTH (C156.2)
GTH_RX_N: U_Signal_Distribution/ANL2 (X5B.71), GTH (C160#1.2)
GTH_RX_N: U_Signal_Distribution/ANL3 (X5C.71), GTH (C164.2)
GTH_RX_P: U_Signal_Distribution/ANL1 (X5A.73), GTH (C155.2)
GTH_RX_P: U_Signal_Distribution/ANL2 (X5B.73), GTH (C159.2)
GTH_RX_P: U_Signal_Distribution/ANL3 (X5C.73), GTH (C163.2)
GTH_TX_N: U_Signal_Distribution/ANL1 (X5A.67), GTH (C154.2)
GTH_TX_N: U_Signal_Distribution/ANL2 (X5B.67), GTH (C158.2)
GTH_TX_N: U_Signal_Distribution/ANL3 (X5C.67), GTH (C162.2)
GTH_TX_P: U_Signal_Distribution/ANL1 (X5A.65), GTH (C153.2)
GTH_TX_P: U_Signal_Distribution/ANL2 (X5B.65), GTH (C157.2)
GTH_TX_P: U_Signal_Distribution/ANL3 (X5C.65), GTH (C161#1.2)
I2C0-Mux~{RST}: J3-3xGTHCLK+1xPLLCLK+MIO+B47+B48 (J3.124), I2C0_Mux (R29.1 U6.3)
JTAGEN_S3C~{DCs}: S3C (R42.1), S3C_FrontpanelInterface (U21.15)
NetR37_2: Rail_Shutdown_AD (U7.14), S3C_IOs1V8 (R37B.1), I2C_Subsystems (R37.2 R45.1), I2C0_Mux (U6.16)
NetR37A_1: Thermal (Ut1.15), S3C_IOs3V3 (R37A.1), I2C_Subsystems (R68.1 U27.6)
NetR38_2: Rail_Shutdown_AD (U7.15), S3C_IOs1V8 (R38B.1), I2C_Subsystems (R38.2 R48.1), I2C0_Mux (U6.15)
NetR38A_1: Thermal (Ut1.14), S3C_IOs3V3 (R38A.1), I2C_Subsystems (R69.1 U27.5)
NetU4A_76: U_Signal_Distribution/DIG1 (U4A.76), U_Signal_Distribution/DIG2 (U4B.76), U_Signal_Distribution/DIG3 (U4C.76), U_Signal_Distribution/DIG4 (U4D.76), U_Signal_Distribution/DIG5 (U4E.76)
NetU4A_77: U_Signal_Distribution/DIG1 (U4A.77), U_Signal_Distribution/DIG2 (U4B.77), U_Signal_Distribution/DIG3 (U4C.77), U_Signal_Distribution/DIG4 (U4D.77), U_Signal_Distribution/DIG5 (U4E.77)
NetU6_13: I2C0_Mux (U6.13), U_Backpanel/U_Backpanel1B (X2B.24)
NetU6_14: I2C0_Mux (U6.14), U_Backpanel/U_Backpanel1B (X2B.26)
NetU6_17: I2C0_Mux (U6.17), U_Backpanel/U_Backpanel2T (X2A.24)
NetU6_18: I2C0_Mux (U6.18), U_Backpanel/U_Backpanel2T (X2A.26)
NetU19_70: S3C_IOs1V8 (U19.70), S3C_SplitSPI (U25.10)
NetU19_99: S3C_IOs1V8 (U19.99), S3C_SplitSPI (U25.9)
NetUi2_12: isoDebug-FTDI (Ui2.12), isoDebug-Isolation (Ui5.3)
NetUi2_13: isoDebug-FTDI (Ui2.13), isoDebug-Isolation (Ui5.4)
NetUi2_14: isoDebug-FTDI (Ui2.14), isoDebug-Isolation (Ui5.6)
NetUi2_15: isoDebug-FTDI (Ui2.15), isoDebug-Isolation (Ui5.5)
NetUi2_22: isoDebug-FTDI (Ui2.22), isoDebug-Isolation (Ui7.3)
NetUi2_23: isoDebug-FTDI (Ui2.23), isoDebug-Isolation (Ui7.4)
NetUi2_24: isoDebug-FTDI (Ui2.24), isoDebug-Isolation (Ui7.6)
NetUi2_25: isoDebug-FTDI (Ui2.25), isoDebug-Isolation (Ui7.5)
NetUi2_32: isoDebug-FTDI (Ui2.32), isoDebug-Isolation (Ui6.3)
NetUi2_33: isoDebug-FTDI (Ui2.33), isoDebug-Isolation (Ui6.6)
NetUi2_42: isoDebug-FTDI (Ui2.42), isoDebug-Isolation (Ui6.4)
NetUi2_46: isoDebug-FTDI (Ui2.46), isoDebug-Isolation (Ui6.5)
PG/~{ALERT}: S3C_IOs3V3 (U19.2), U_S3C_SupplyAndMonitoring/U_PwrMon_VIN_10V (R106A.1 TP33A.1 U28A.3)
PG/~{ALERT}: S3C_IOs3V3 (U19.3), U_S3C_SupplyAndMonitoring/U_PwrMon_VIN_6V (R106B.1 TP33B.1 U28B.3)
PG_Module: J2-1xGTHQ_L+1xGTHCLK+GTRQ+2xGTRCLK+4xPLLCLK+CFG+STAT (J2.104 R16.1), Power_Supply_2 (R203A.1 R203B.1 TP46.1), S3C_IOs3V3 (U19.9)
PS_I2C0_SCL: J3-3xGTHCLK+1xPLLCLK+MIO+B47+B48 (J3.74), I2C_Subsystems (R37.1 R65.1), I2C0_Mux (U6.22)
PS_I2C0_SDA: J3-3xGTHCLK+1xPLLCLK+MIO+B47+B48 (J3.76), I2C_Subsystems (R38.1 R66.1), I2C0_Mux (U6.23)
PS_I2C1_SCL: J2-1xGTHQ_L+1xGTHCLK+GTRQ+2xGTRCLK+4xPLLCLK+CFG+STAT (J2.90 TP6.1), J3-3xGTHCLK+1xPLLCLK+MIO+B47+B48 (J3.78), I2C_Subsystems (R47.1 U26.6 U27.3)
PS_I2C1_SDA: J2-1xGTHQ_L+1xGTHCLK+GTRQ+2xGTRCLK+4xPLLCLK+CFG+STAT (J2.92 TP7.1), J3-3xGTHCLK+1xPLLCLK+MIO+B47+B48 (J3.80), I2C_Subsystems (R46.1 U26.5 U27.4)
PS_SPI0.CLK: U_Signal_Distribution/DIG1 (U4A.31), U_Signal_Distribution/DIG2 (U4B.31), U_Signal_Distribution/DIG3 (U4C.31), U_Signal_Distribution/DIG4 (U4D.31), U_Signal_Distribution/DIG5 (U4E.31), S3C_IOs1V8 (U19.44)
PS_SPI0.MISO: U_Signal_Distribution/DIG1 (U4A.32), U_Signal_Distribution/DIG2 (U4B.32), U_Signal_Distribution/DIG3 (U4C.32), U_Signal_Distribution/DIG4 (U4D.32), U_Signal_Distribution/DIG5 (U4E.32), S3C_IOs1V8 (U19.45)
PS_SPI0.MOSI: U_Signal_Distribution/DIG1 (U4A.49), U_Signal_Distribution/DIG2 (U4B.49), U_Signal_Distribution/DIG3 (U4C.49), U_Signal_Distribution/DIG4 (U4D.49), U_Signal_Distribution/DIG5 (U4E.49), S3C_IOs1V8 (U19.71)
PS_UART0_RX: J3-3xGTHCLK+1xPLLCLK+MIO+B47+B48 (J3.82), isoDebug-Isolation (Ui6.14)
PS_UART0_TX: J3-3xGTHCLK+1xPLLCLK+MIO+B47+B48 (J3.71), isoDebug-Isolation (Ui6.11)
PS_UART1_RX: J3-3xGTHCLK+1xPLLCLK+MIO+B47+B48 (J3.75), isoDebug-Isolation (Ui6.13)
PS_UART1_TX: J3-3xGTHCLK+1xPLLCLK+MIO+B47+B48 (J3.73), isoDebug-Isolation (Ui6.12)
PSBATT: J2-1xGTHQ_L+1xGTHCLK+GTRQ+2xGTRCLK+4xPLLCLK+CFG+STAT (J2.125), J2_RefClkAndRTC (C99.2 U18.1)
RailEn: Signal_Distribution (R70.1 R71.1 R72.1 R73.1), U_Signal_Distribution/DIG1/U_RP-SlotD (R33AD-A.1), U_Signal_Distribution/DIG2/U_RP-SlotD (R33AD-B.1), U_Signal_Distribution/DIG3/U_RP-SlotD (R33AD-C.1), U_Signal_Distribution/DIG4/U_RP-SlotD (R33AD-D.1), U_Signal_Distribution/DIG5/U_RP-SlotD (R33AD-E.1), U_Signal_Distribution/ANL1/U_RP-SlotA (R33AD-F.1), U_Signal_Distribution/ANL2/U_RP-SlotA (R33AD-G.1), U_Signal_Distribution/ANL3/U_RP-SlotA (R33AD-H.1), U_Backpanel/U_Backpanel2T/U_RP-BP (R33BP-A.1), U_Backpanel/U_Backpanel1B/U_RP-BP (R33BP-B.1)
RailFO_A1: U_Signal_Distribution/ANL1/U_RP-SlotA (D5F.3), Rail_Shutdown_AD (U7.4)
RailFO_A2: U_Signal_Distribution/ANL2/U_RP-SlotA (D5G.3), Rail_Shutdown_AD (U7.12)
RailFO_A3: U_Signal_Distribution/ANL3/U_RP-SlotA (D5H.3), Rail_Shutdown_AD (U7.5)
RailFO_D1: U_Signal_Distribution/DIG1/U_RP-SlotD (D5A.3), Rail_Shutdown_AD (U7.11)
RailFO_D2: U_Signal_Distribution/DIG2/U_RP-SlotD (D5B.3), Rail_Shutdown_AD (U7.6)
RailFO_D3: U_Signal_Distribution/DIG3/U_RP-SlotD (D5C.3), Rail_Shutdown_AD (U7.10)
RailFO_D4: U_Signal_Distribution/DIG4/U_RP-SlotD (D5D.3), Rail_Shutdown_AD (U7.7)
RailFO_D5: U_Signal_Distribution/DIG5/U_RP-SlotD (D5E.3), Rail_Shutdown_AD (U7.9)
~{SPI_CS_1V8}1: U_Signal_Distribution/DIG1 (U4A.48), S3C_SplitSPI (U25.15)
~{SPI_CS_1V8}2: U_Signal_Distribution/DIG2 (U4B.48), S3C_SplitSPI (U25.14)
~{SPI_CS_1V8}3: U_Signal_Distribution/DIG3 (U4C.48), S3C_SplitSPI (U25.13)
~{SPI_CS_1V8}4: U_Signal_Distribution/DIG4 (U4D.48), S3C_SplitSPI (U25.12)
~{SPI_CS_1V8}5: U_Signal_Distribution/DIG5 (U4E.48), S3C_SplitSPI (U25.11)
SD_CLK: J3-3xGTHCLK+1xPLLCLK+MIO+B47+B48 (J3.114), SD_Card (U13.9)
SD_CMD: J3-3xGTHCLK+1xPLLCLK+MIO+B47+B48 (J3.113), SD_Card (U13.4)
SD_DAT0: J3-3xGTHCLK+1xPLLCLK+MIO+B47+B48 (J3.105), SD_Card (U13.6)
SD_DAT1: J3-3xGTHCLK+1xPLLCLK+MIO+B47+B48 (J3.107), SD_Card (U13.7)
SD_DAT2: J3-3xGTHCLK+1xPLLCLK+MIO+B47+B48 (J3.109), SD_Card (U13.1)
SD_DAT3: J3-3xGTHCLK+1xPLLCLK+MIO+B47+B48 (J3.111), SD_Card (U13.3)
TCK: J2-1xGTHQ_L+1xGTHCLK+GTRQ+2xGTRCLK+4xPLLCLK+CFG+STAT (J2.120), isoDebug-Isolation (Ui5.14)
TDI: J2-1xGTHQ_L+1xGTHCLK+GTRQ+2xGTRCLK+4xPLLCLK+CFG+STAT (J2.122), isoDebug-Isolation (Ui5.13)
TDO: J2-1xGTHQ_L+1xGTHCLK+GTRQ+2xGTRCLK+4xPLLCLK+CFG+STAT (J2.124), isoDebug-Isolation (Ui5.11)
TMS: J2-1xGTHQ_L+1xGTHCLK+GTRQ+2xGTRCLK+4xPLLCLK+CFG+STAT (J2.126), isoDebug-Isolation (Ui5.12)
VIN2: Power_Supply_Input (R109.1 R110.2), S3C_SupplyAndMonitoring (F2.1)
VIN3: S3C_SupplyAndMonitoring (D7.2 D8.1 F2.2), U_S3C_SupplyAndMonitoring/U_PwrMon_VIN_10V (R105A.2), U_S3C_SupplyAndMonitoring/U_PwrMon_VIN_6V (R105B.2)
VIN4: S3C_SupplyAndMonitoring (6 pins), U_S3C_SupplyAndMonitoring/3V3_S3C (L11D.2)
VIN_~{FLT}_OD_BPs: Backpanel (R34BPs.1 R35BPs.1), U_Backpanel/U_Backpanel2T/U_RP-BP (U1BP-A.3), U_Backpanel/U_Backpanel1B/U_RP-BP (U1BP-B.3)
VIN_SWITCHED_ASLOT-_ANL1: U_Signal_Distribution/ANL1 (X5A.5 X5A.6), U_Signal_Distribution/ANL1/U_RP-SlotA (U1AD-F.7)
VIN_SWITCHED_ASLOT-_ANL2: U_Signal_Distribution/ANL2 (X5B.5 X5B.6), U_Signal_Distribution/ANL2/U_RP-SlotA (U1AD-G.7)
VIN_SWITCHED_ASLOT-_ANL3: U_Signal_Distribution/ANL3 (X5C.5 X5C.6), U_Signal_Distribution/ANL3/U_RP-SlotA (U1AD-H.7)
VIN_SWITCHED_BP-_U_Backpanel1B: U_Backpanel/U_Backpanel1B (X2B.10 X2B.12 X2B.14), U_Backpanel/U_Backpanel1B/U_RP-BP (U1BP-B.7)
VIN_SWITCHED_BP-_U_Backpanel2T: U_Backpanel/U_Backpanel2T (X2A.10 X2A.12 X2A.14), U_Backpanel/U_Backpanel2T/U_RP-BP (U1BP-A.7)
VIN_SWITCHED_DSLOT-_DIG1: U_Signal_Distribution/DIG1 (X6A.5 X6A.6), U_Signal_Distribution/DIG1/U_RP-SlotD (U1AD-A.7)
VIN_SWITCHED_DSLOT-_DIG2: U_Signal_Distribution/DIG2 (X6B.5 X6B.6), U_Signal_Distribution/DIG2/U_RP-SlotD (U1AD-B.7)
VIN_SWITCHED_DSLOT-_DIG3: U_Signal_Distribution/DIG3 (X6C.5 X6C.6), U_Signal_Distribution/DIG3/U_RP-SlotD (U1AD-C.7)
VIN_SWITCHED_DSLOT-_DIG4: U_Signal_Distribution/DIG4 (X6D.5 X6D.6), U_Signal_Distribution/DIG4/U_RP-SlotD (U1AD-D.7)
VIN_SWITCHED_DSLOT-_DIG5: U_Signal_Distribution/DIG5 (X6E.5 X6E.6), U_Signal_Distribution/DIG5/U_RP-SlotD (U1AD-E.7)

## Assembly variants
Rev06Batch00: not fitted D9 D13 R16 R19 R26 R27 R32AD-A R32AD-B R32AD-C R32AD-D R32AD-E R32AD-F R32AD-G R32AD-H R32BP-A R32BP-B R37 R38 R44 R89 R96 R200A R200B R200C R200D R221 R223 Rt6 X3 X15